# EAGLE schematic reprap (EAGLE 6.3)
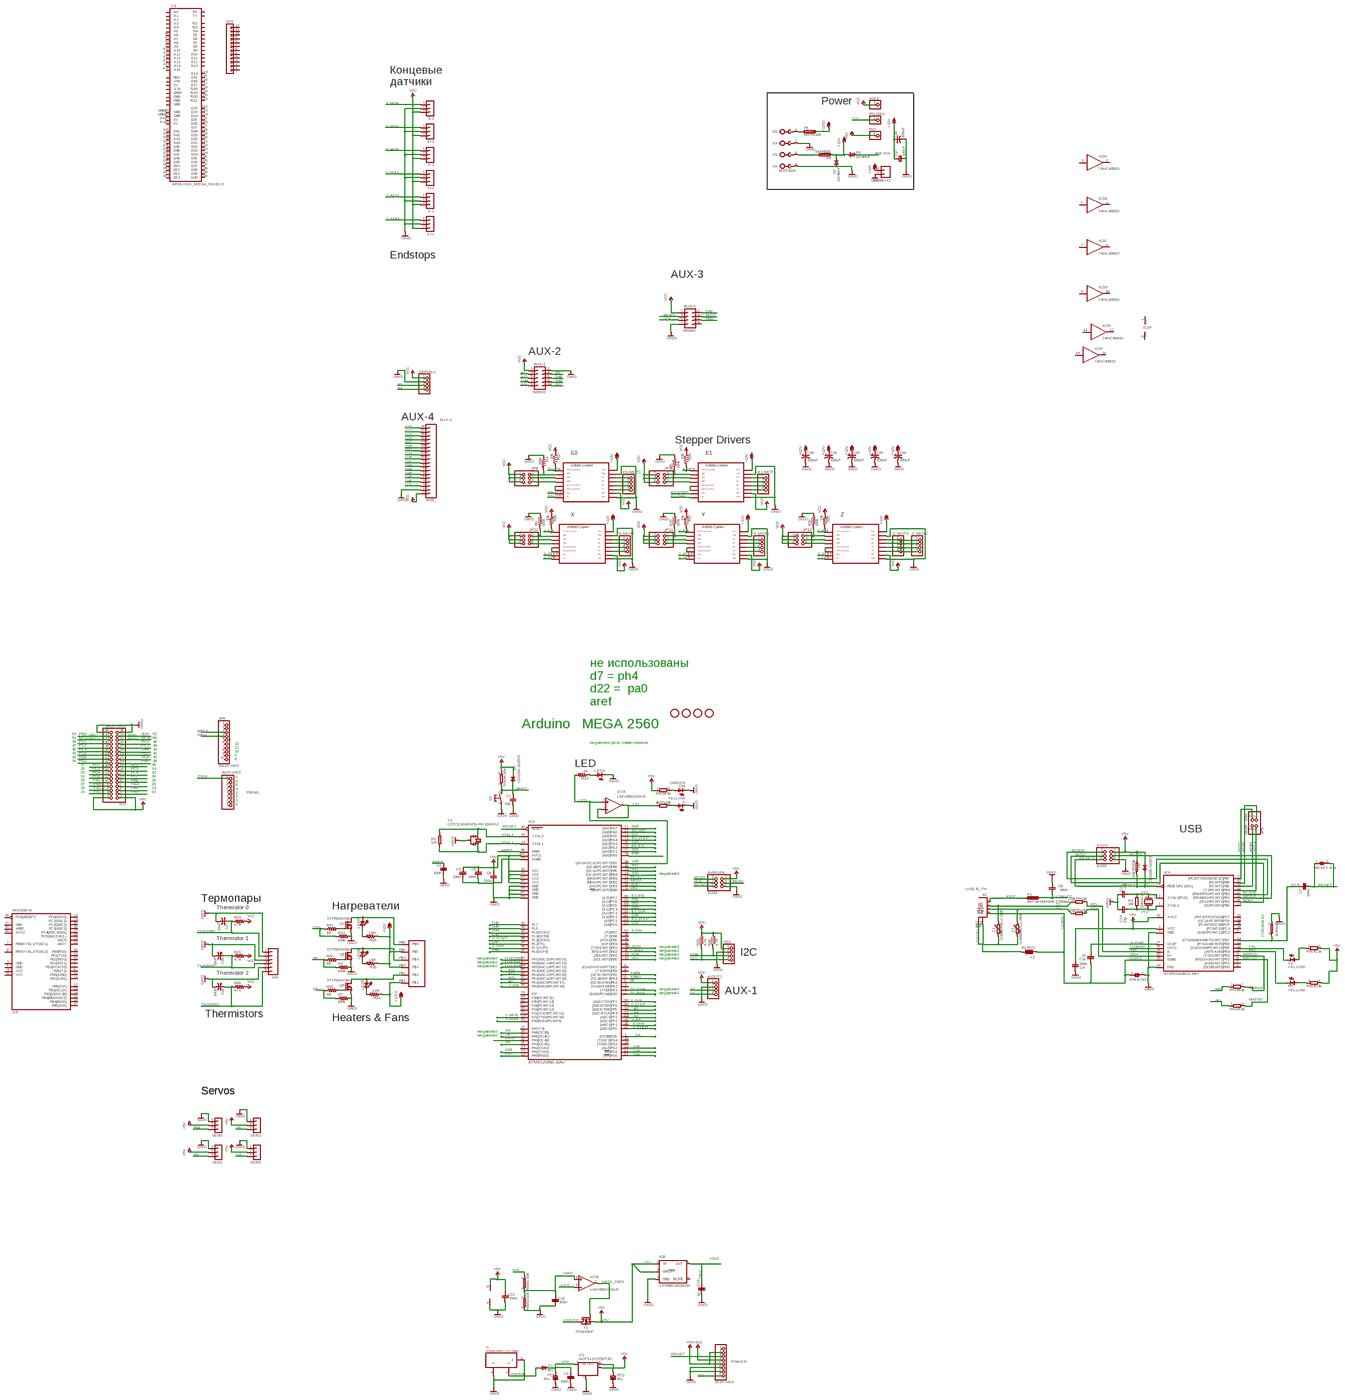
[diagram p0: schematic, sheet 1, overview]
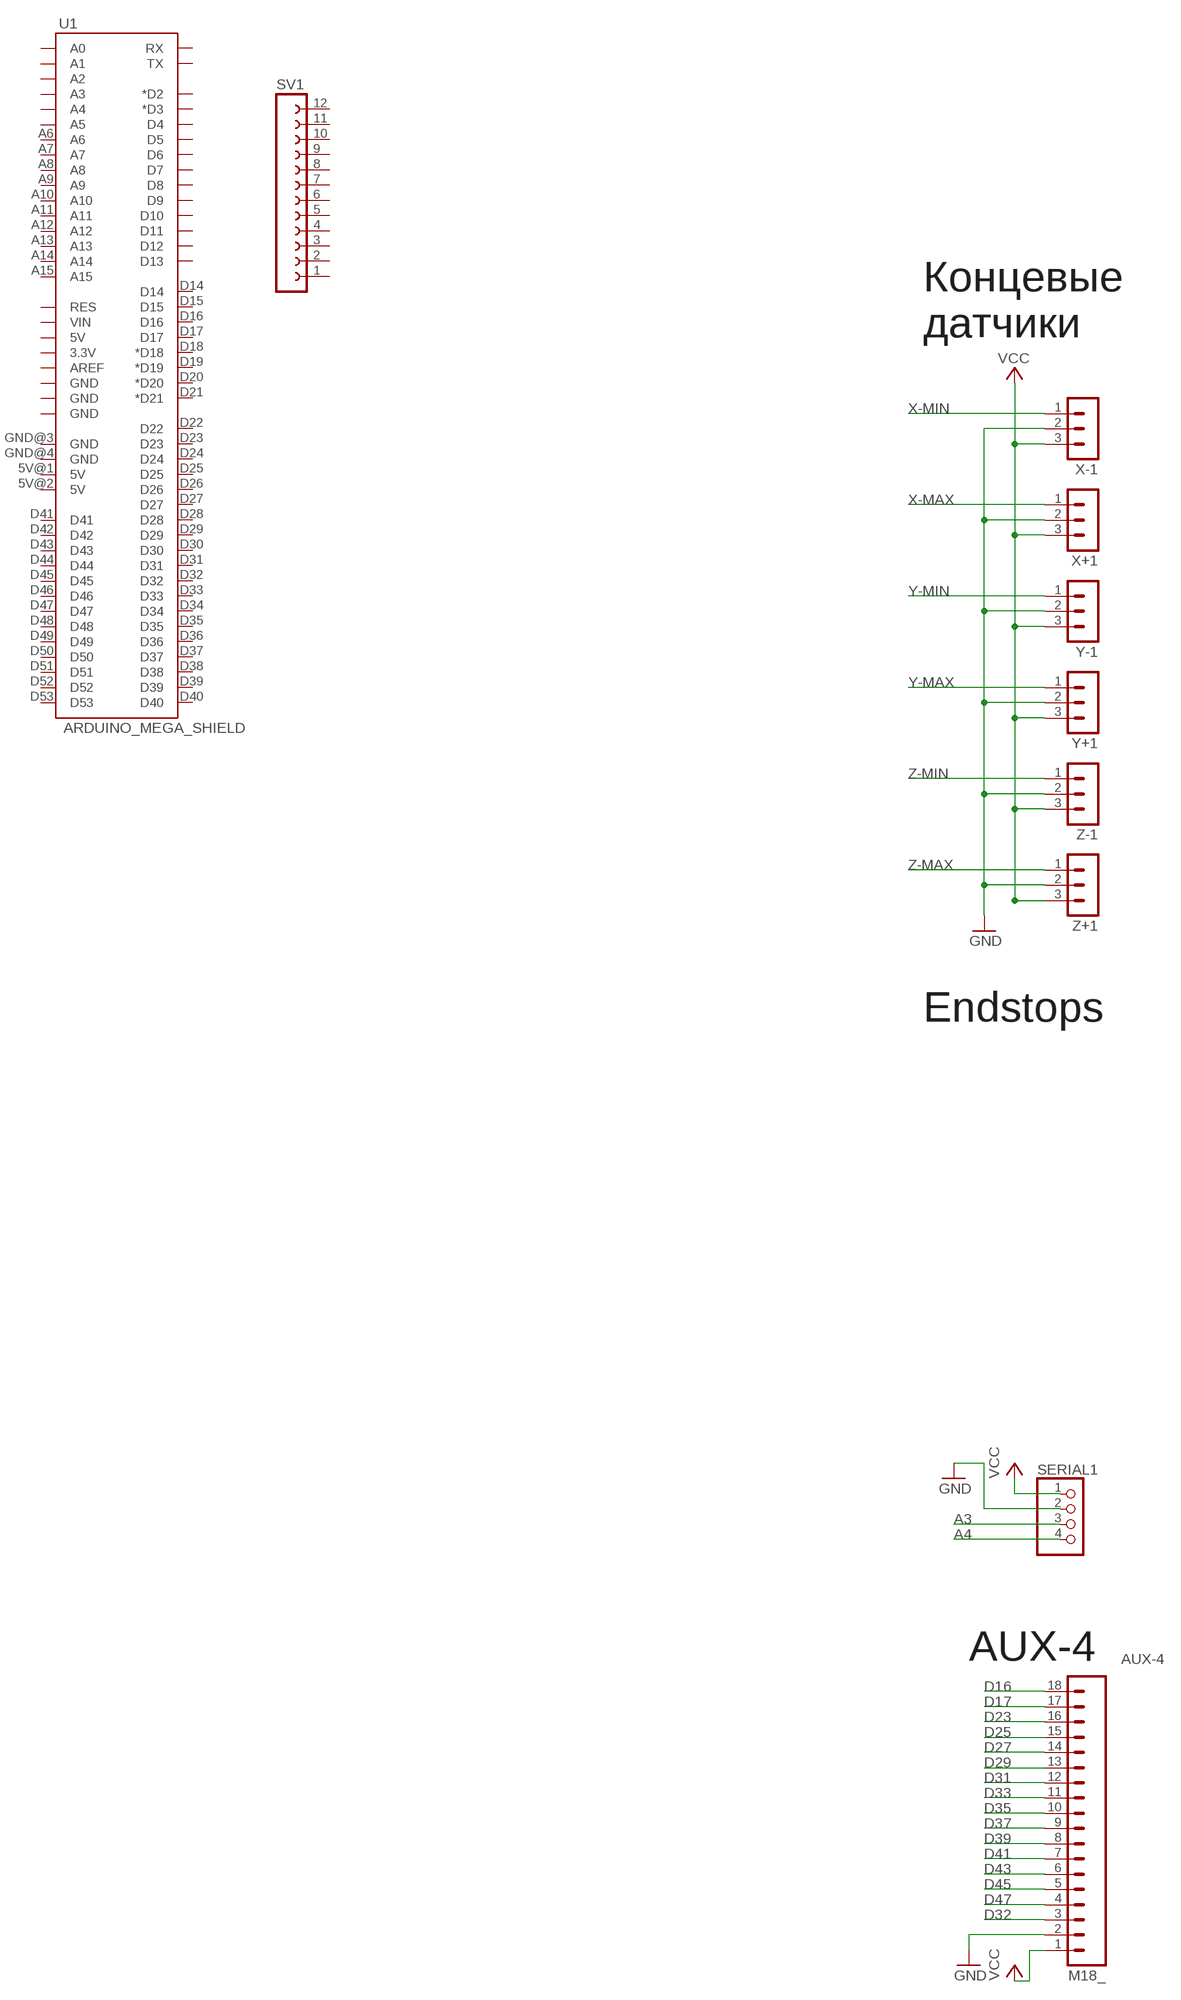
[diagram p1: schematic, sheet 1, part 1 of 4]
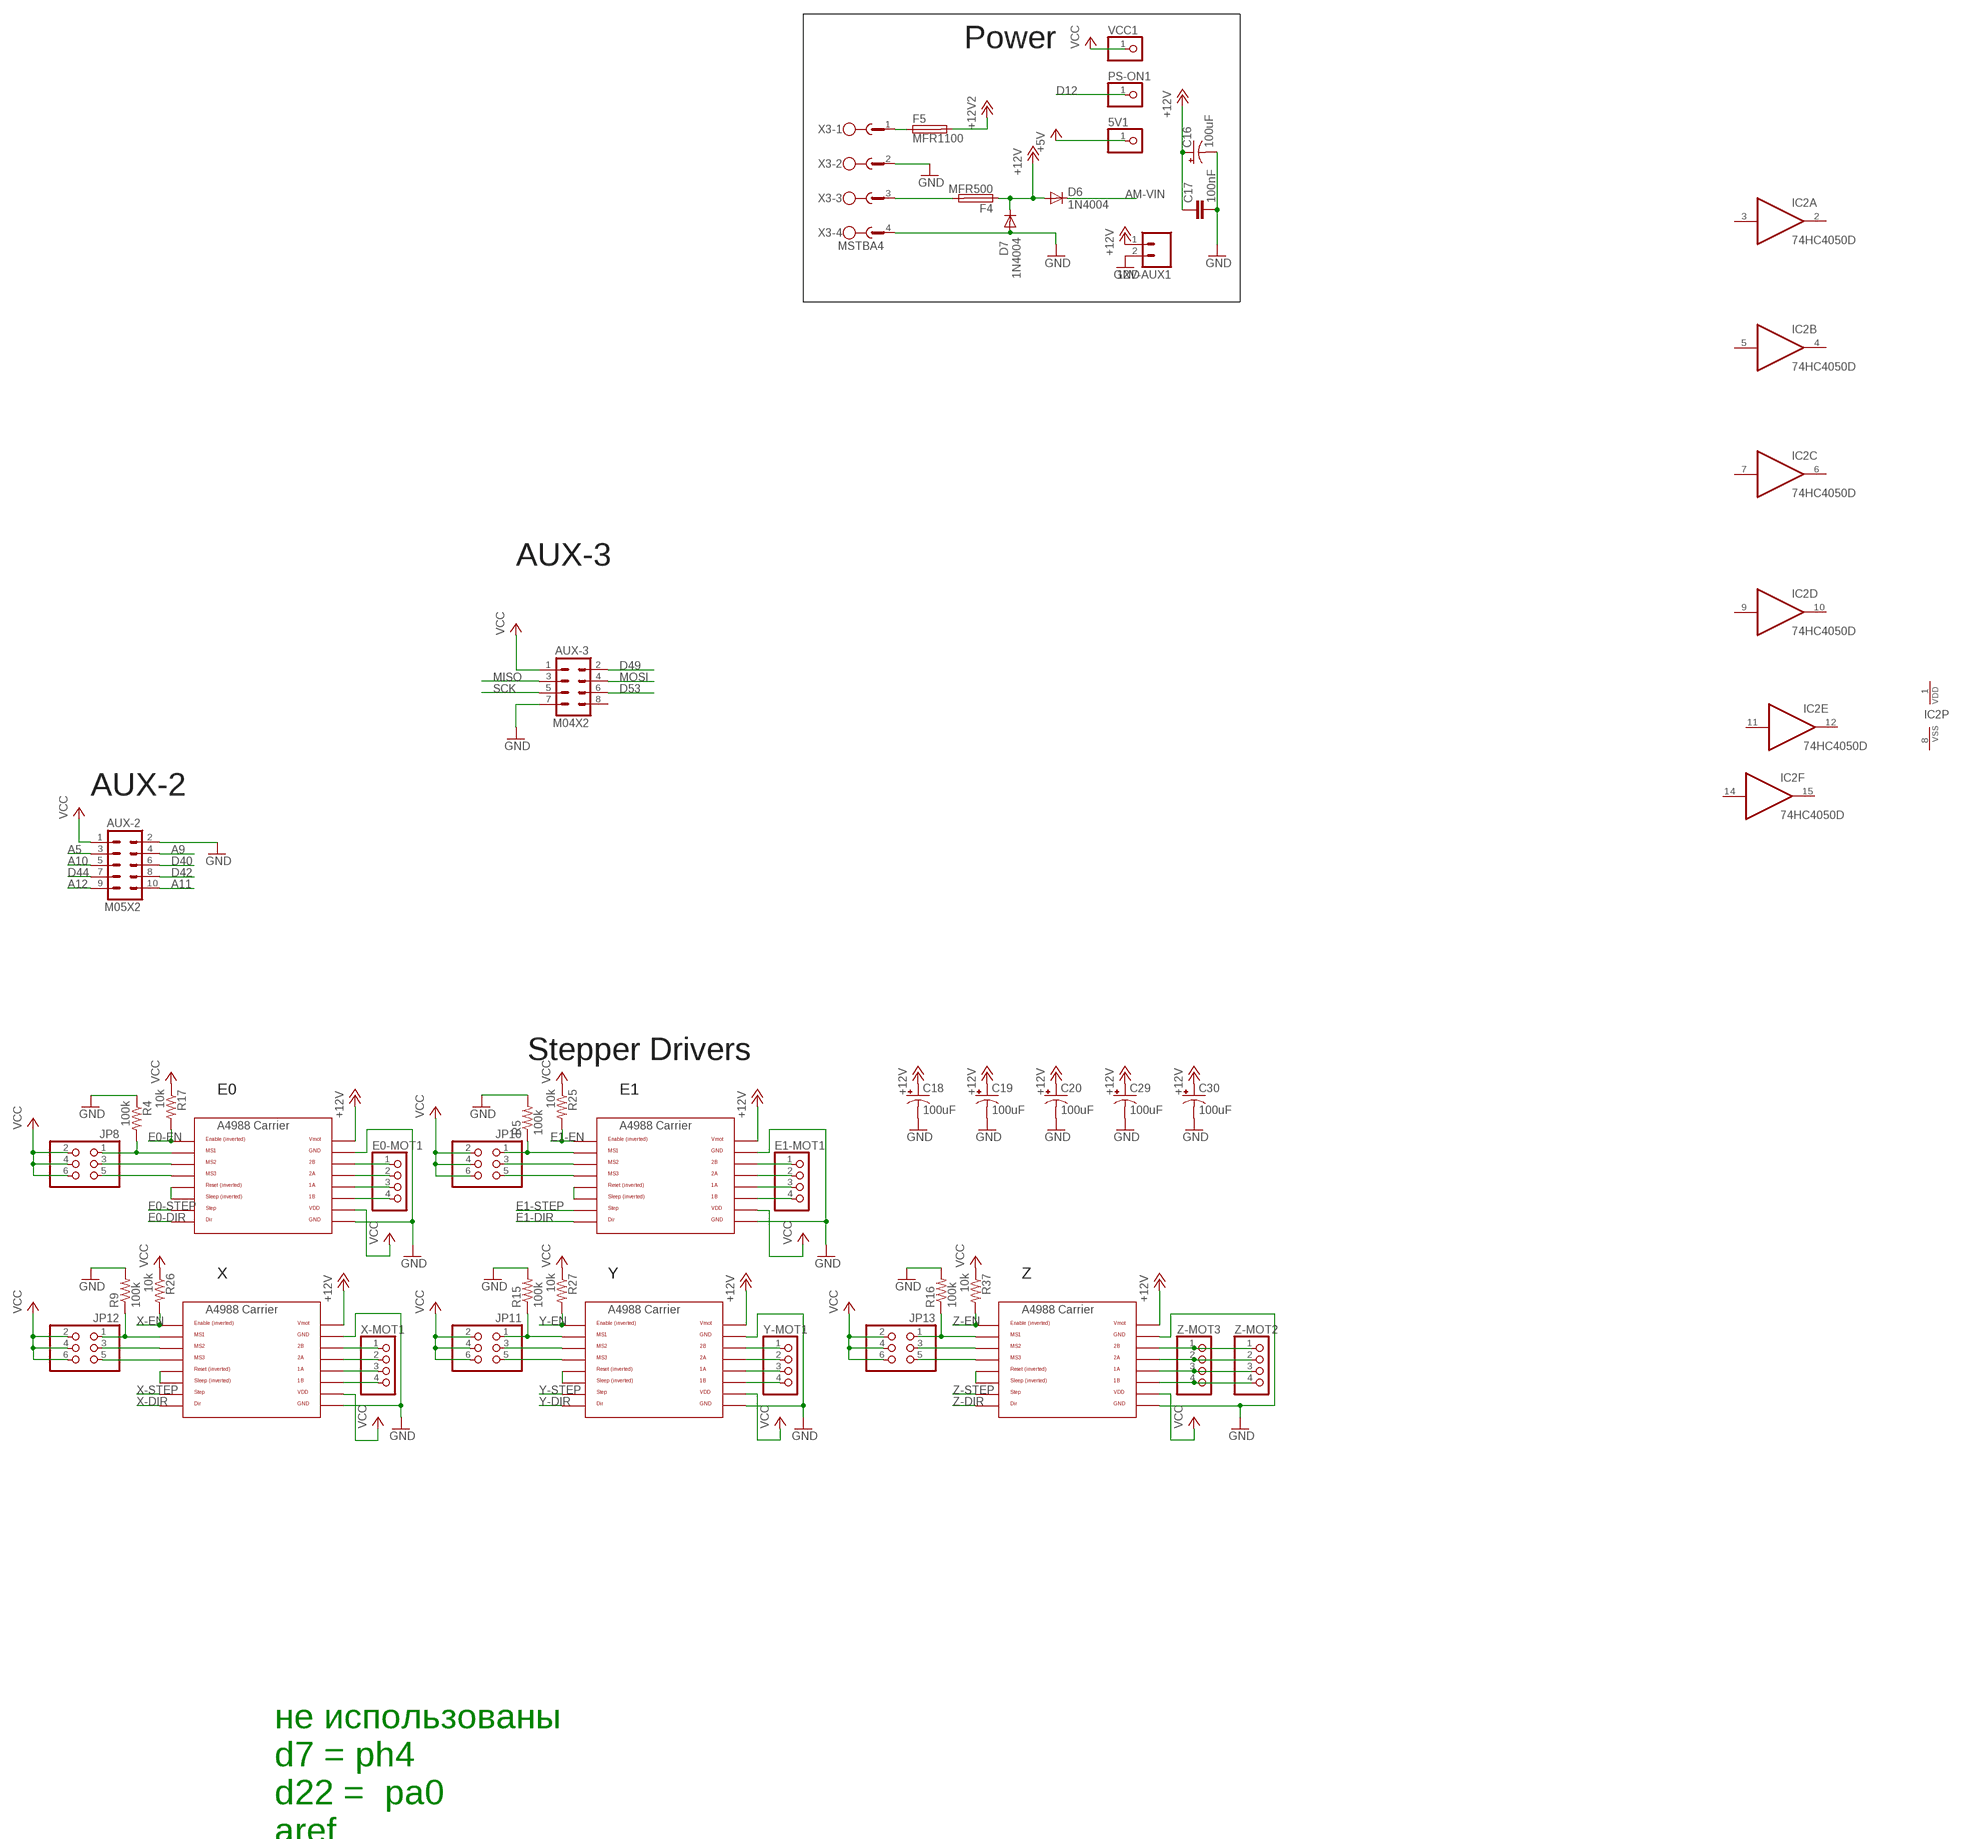
[diagram p2: schematic, sheet 1, part 2 of 4]
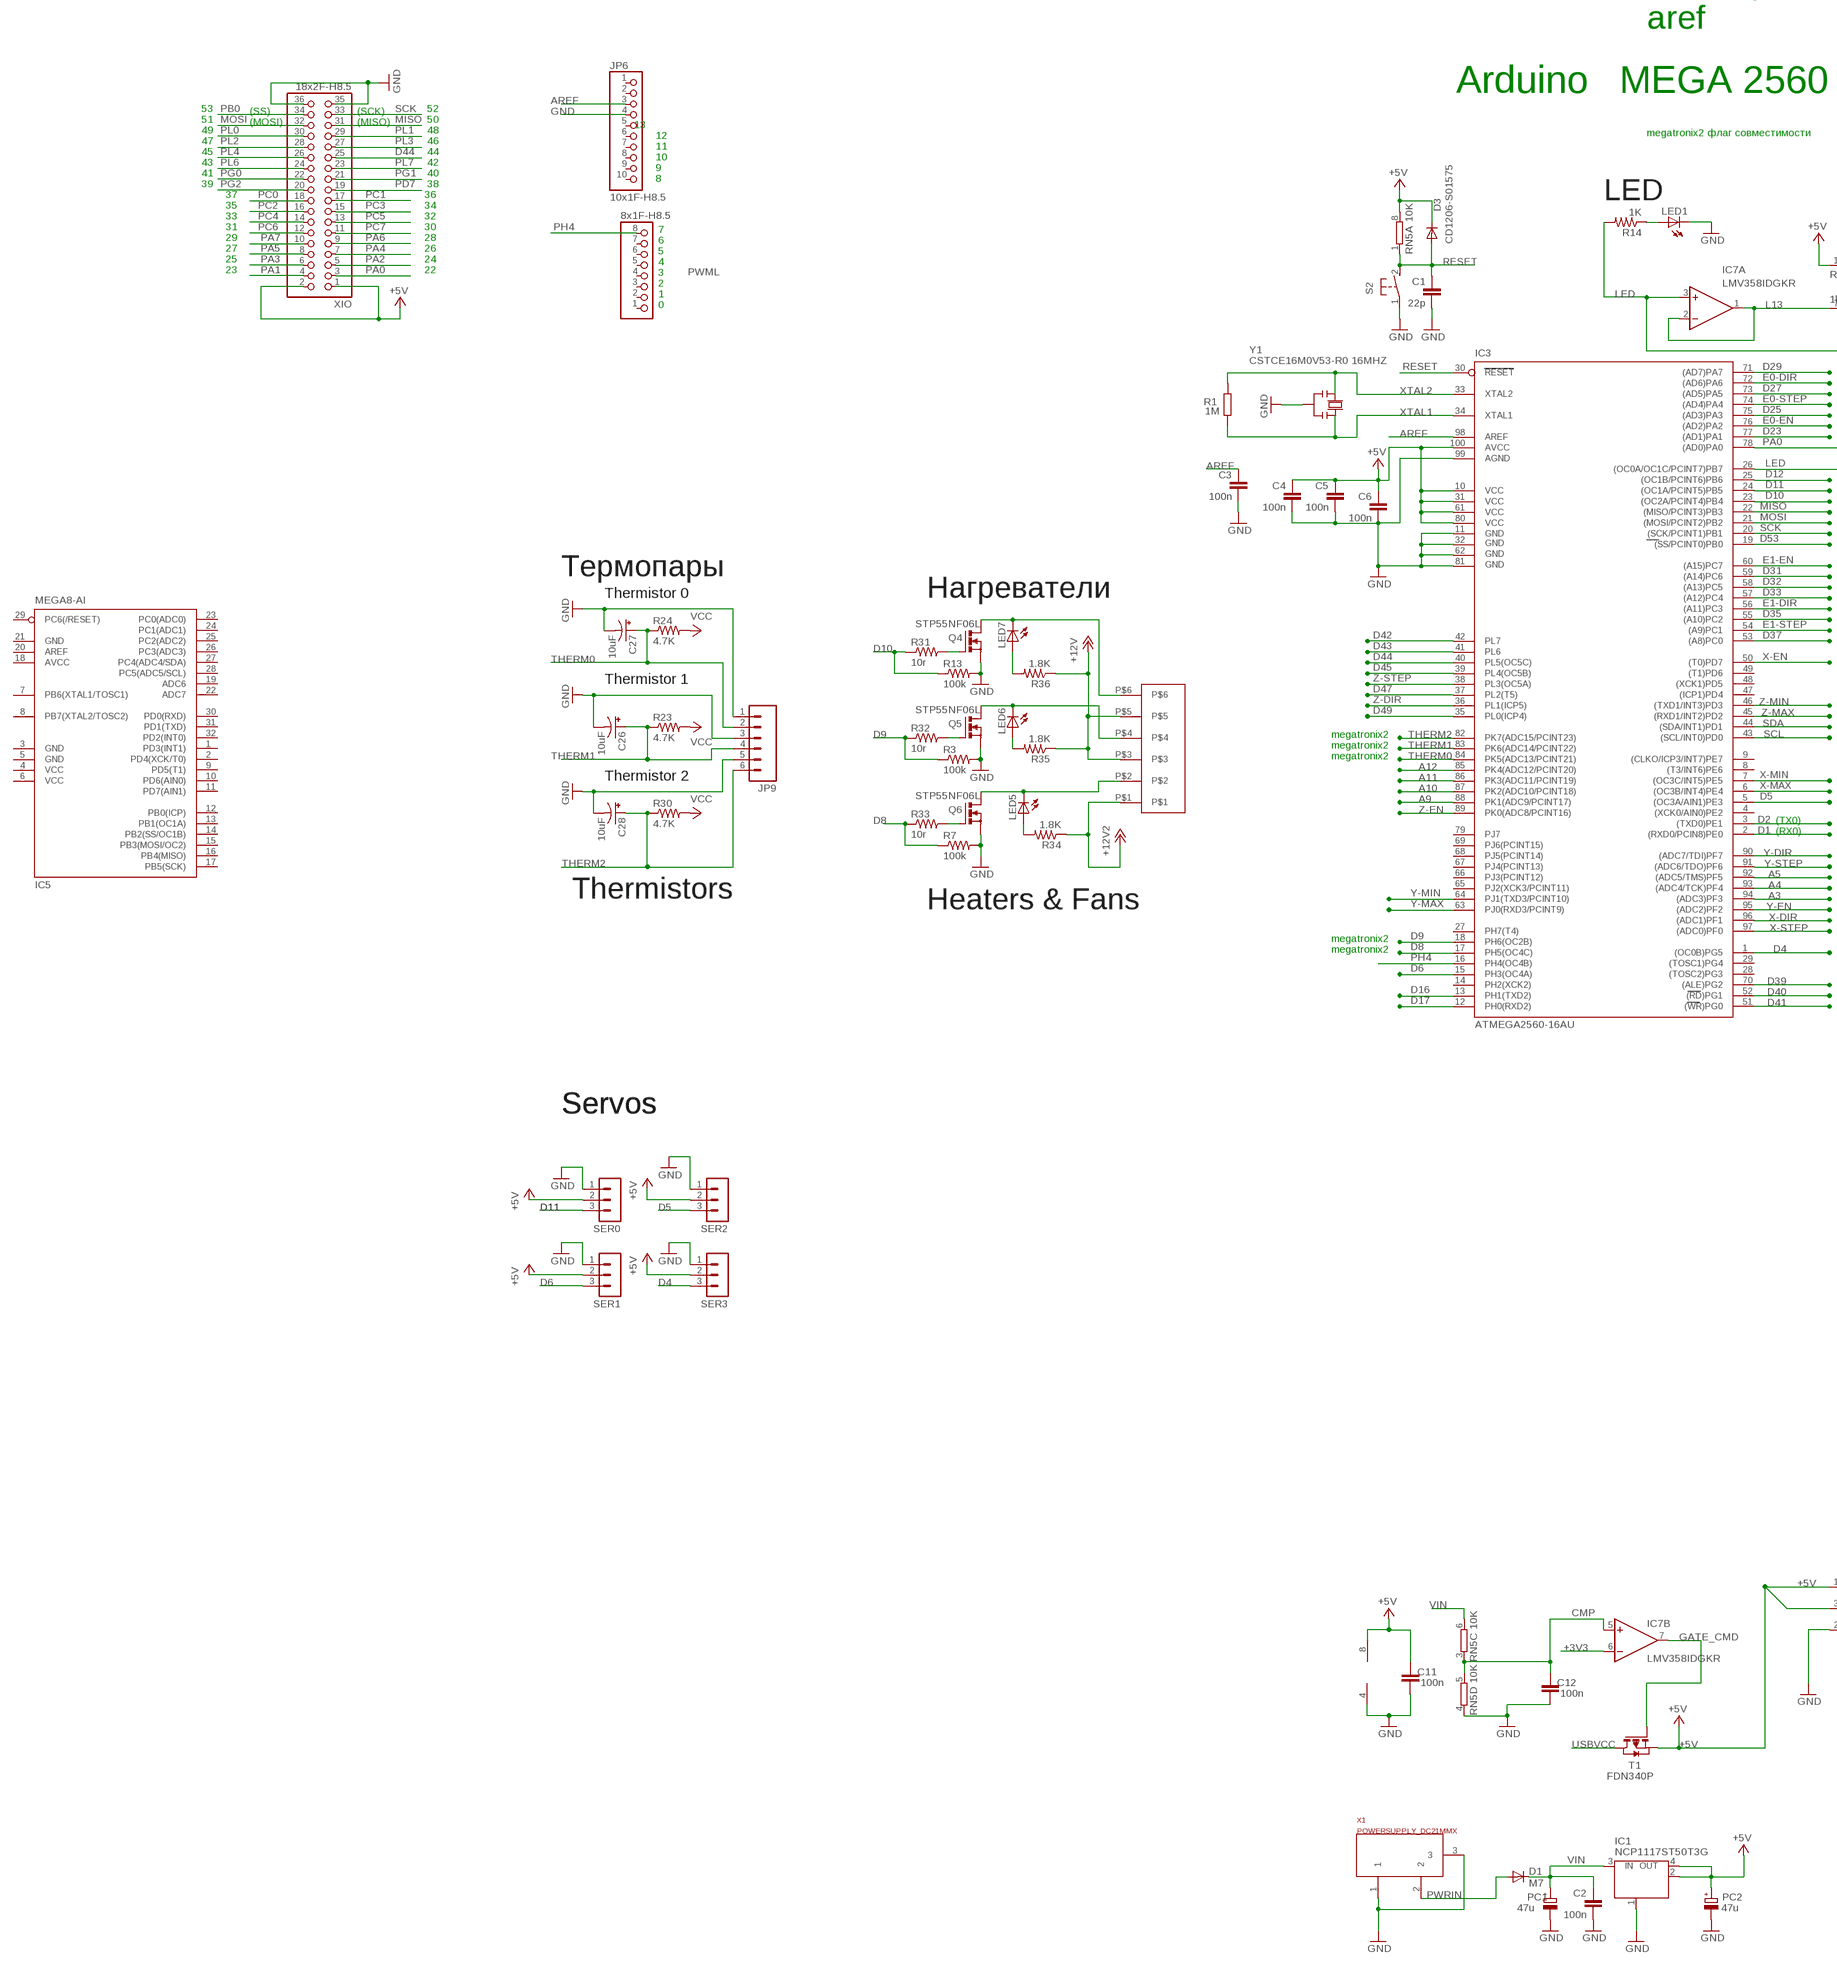
[diagram p3: schematic, sheet 1, part 3 of 4]
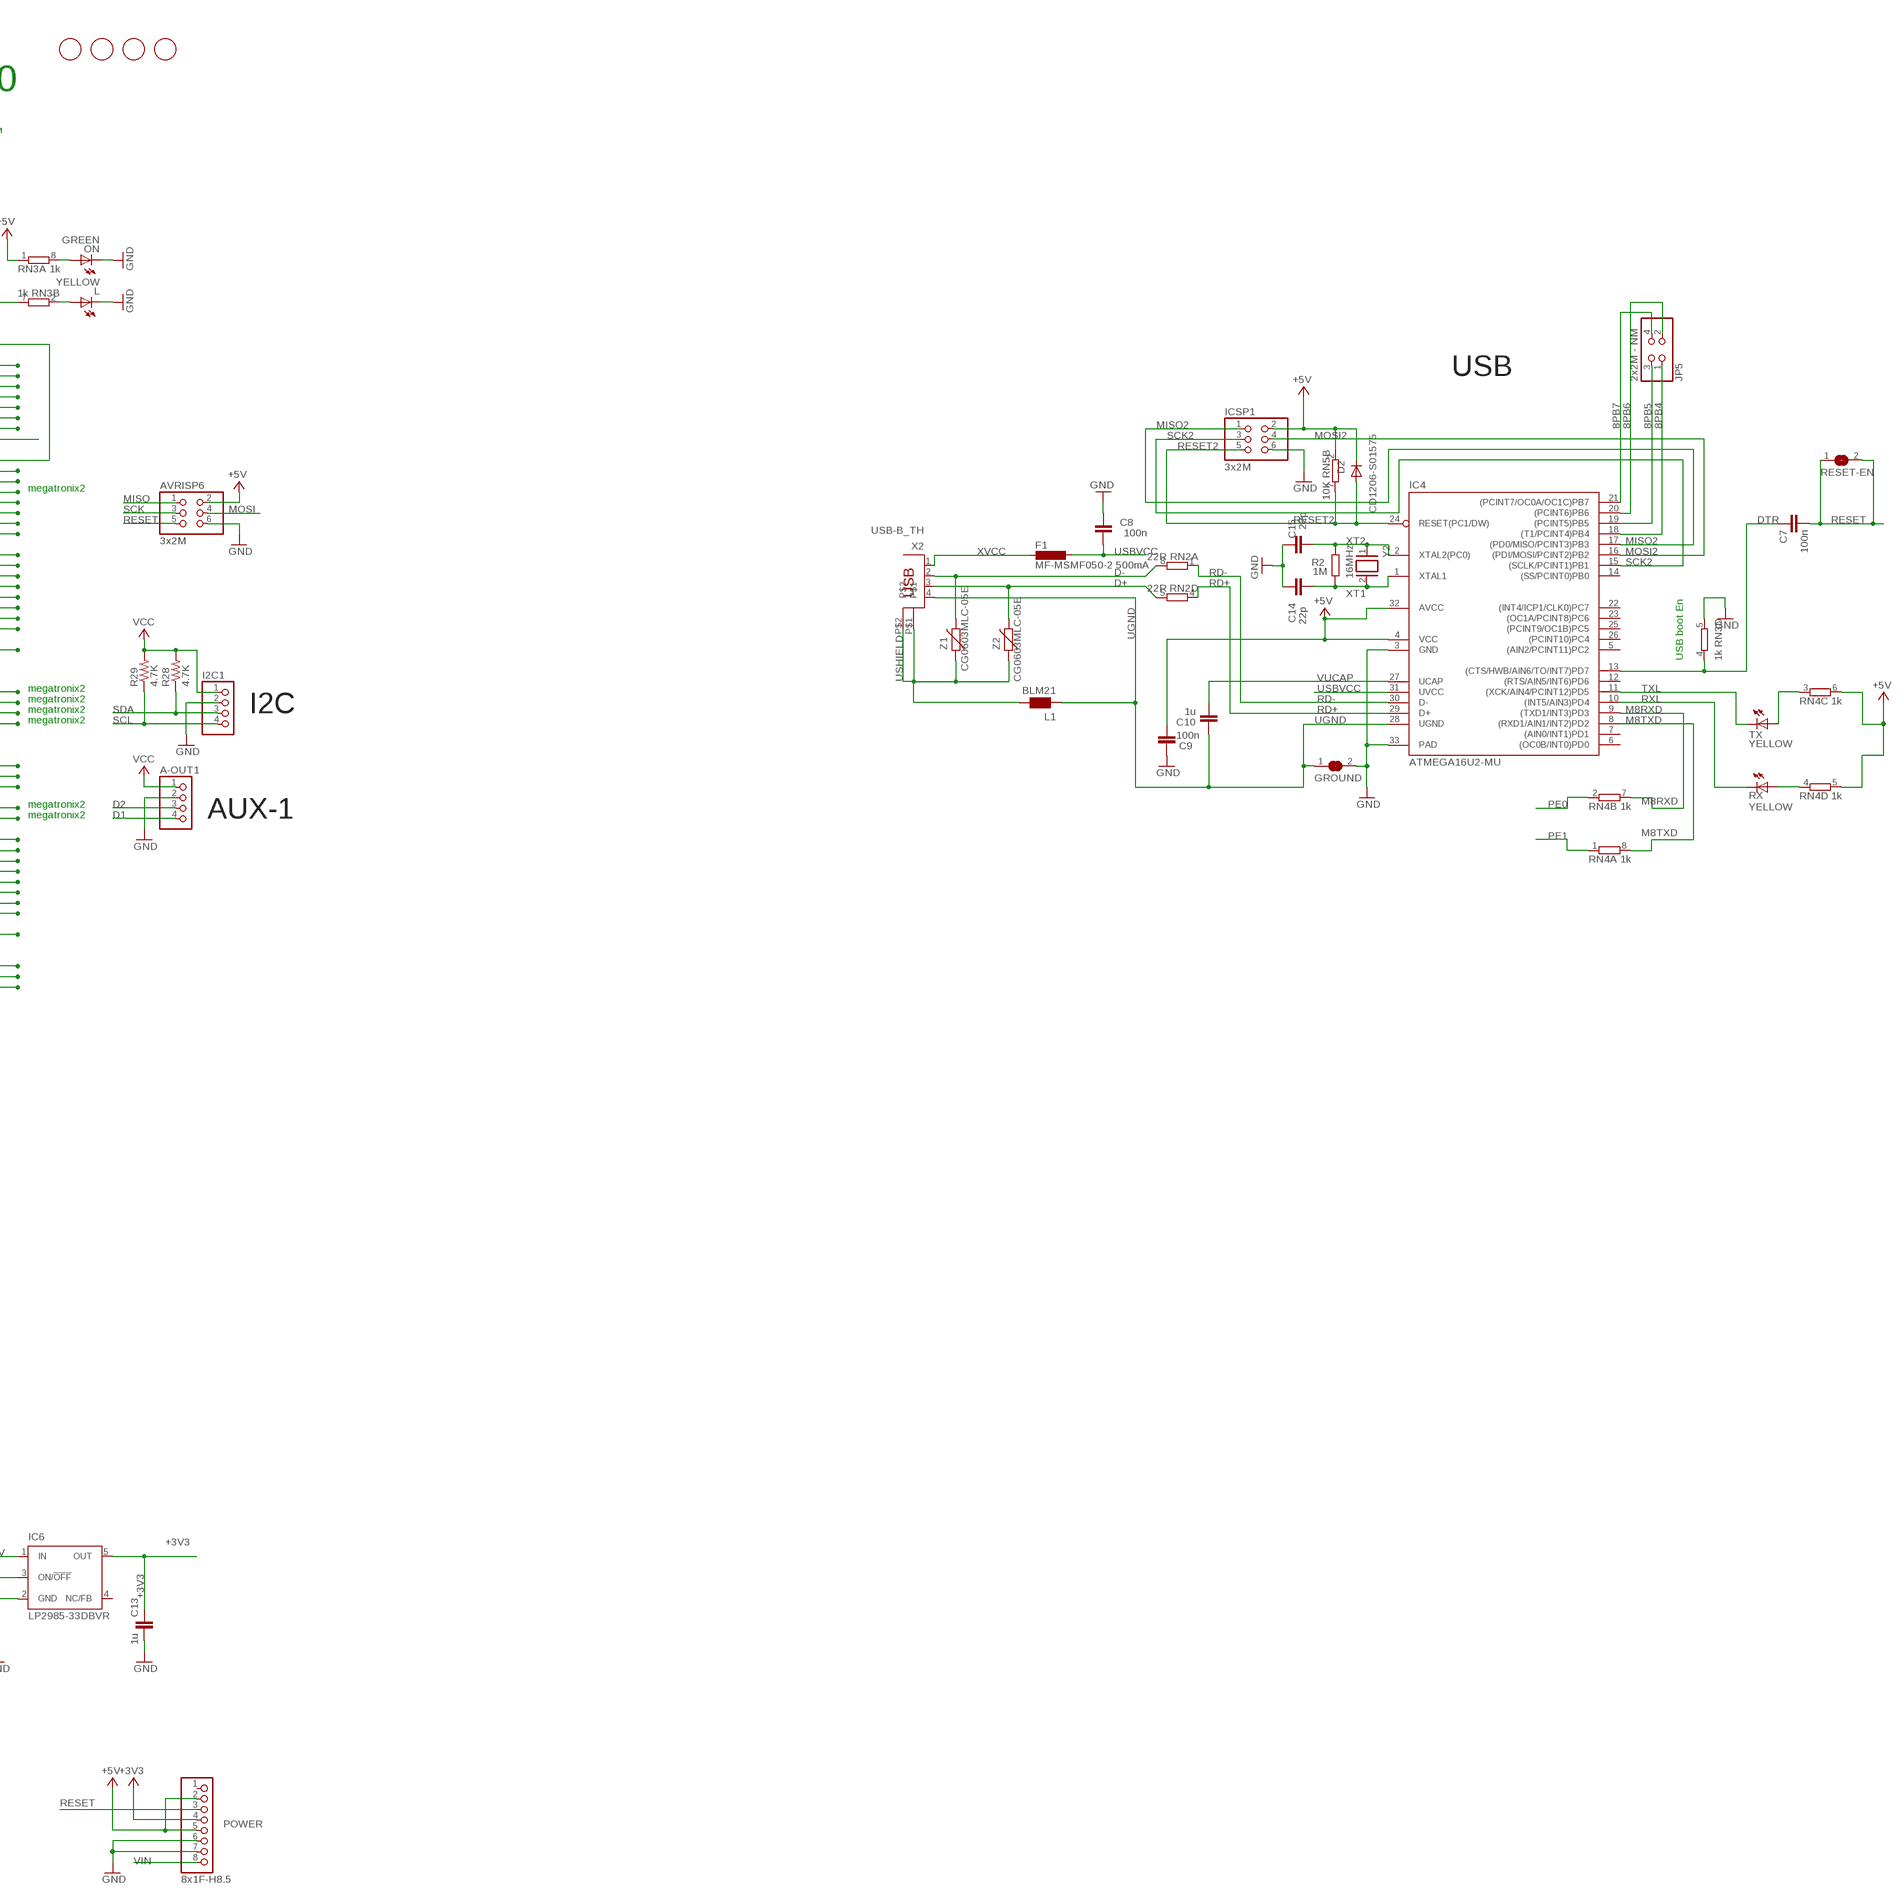
[diagram p4: schematic, sheet 1, part 4 of 4]

## Parts
5V1  PINHD-1X1  [1X01]
12V-AUX1  M02PTH  [1X02]
A-OUT1  PINHD-1X4  [1X04]
AUX-2  M05X2  [2X5]
AUX-3  M04X2  [2X4]
AUX-4  M18_  [1X18]
AVRISP6  3x2M  PINHD-2X3  [2X03]
C1  22p  C-EU0603-RND  [C0603-ROUND]
C2  100n  C-EU0603-RND  [C0603-ROUND]
C3  100n  C-EU0603-RND  [C0603-ROUND]
C4  100n  C-EU0603-RND  [C0603-ROUND]
C5  100n  C-EU0603-RND  [C0603-ROUND]
C6  100n  C-EU0603-RND  [C0603-ROUND]
C7  100n  C-EU0603-RND  [C0603-ROUND]
C8  100n  C-EU0603-RND  [C0603-ROUND]
C9  100n  C-EU0603-RND  [C0603-ROUND]
C10  1u  C-EU0603-RND  [C0603-ROUND]
C11  100n  C-EU0603-RND  [C0603-ROUND]
C12  100n  C-EU0603-RND  [C0603-ROUND]
C13  1u  C-EU0603-RND  [C0603-ROUND]
C14  22p  C-EU0603-RND  [C0603-ROUND]
C15  22p  C-EU0603-RND  [C0603-ROUND]
C16  100uF  CPOL-US153CLV-0605  [153CLV-0605]
C17  100nF  C-EUC0805  [C0805]
C18  100uF  CPOL-US153CLV-0605  [153CLV-0605]
C19  100uF  CPOL-US153CLV-0605  [153CLV-0605]
C20  100uF  CPOL-US153CLV-0605  [153CLV-0605]
C26  10uF  CPOL-US153CLV-0405  [153CLV-0405]
C27  10uF  CPOL-US153CLV-0405  [153CLV-0405]
C28  10uF  CPOL-US153CLV-0405  [153CLV-0405]
C29  100uF  CPOL-US153CLV-0605  [153CLV-0605]
C30  100uF  CPOL-US153CLV-0605  [153CLV-0605]
D1  M7  DIODE-SMB  [SMB]
D2  CD1206-S01575  DIODE-MINIMELF  [MINIMELF]
D3  CD1206-S01575  DIODE-MINIMELF  [MINIMELF]
D6  1N4004  [DO41-10]
D7  1N4004  [DO41-10]
E0-MOT1  PINHD-1X4  [1X04]
E1-MOT1  PINHD-1X4  [1X04]
F1  MF-MSMF050-2 500mA  L-EUL1812  [L1812]
F4  MFR500  PTCFUSE  [MFR500]
F5  MFR1100  PTCFUSEMFR1100  [MFR1100]
FD1  FIDUCIALMOUNT  [FIDUCIA-MOUNT]
FD2  FIDUCIALMOUNT  [FIDUCIA-MOUNT]
FD3  FIDUCIALMOUNT  [FIDUCIA-MOUNT]
FD4  FIDUCIALMOUNT  [FIDUCIA-MOUNT]
GROUND  SJ  [SJ]
I2C1  PINHD-1X4  [1X04]
IC1  NCP1117ST50T3G  MC33269ST-3.3T3  [SOT223]
IC2  74HC4050D  4050D  [SO16]
IC3  ATMEGA2560-16AU  ATMEGA25602560-16AU  [TQFP100]
IC4  ATMEGA16U2-MU  [MLF32]
IC5  MEGA8-AI  [TQFP32-08]
IC6  LP2985-33DBVR  LP2985-XXDBVR33  [SOT23-DBV]
IC7  LMV358IDGKR  LMV358MMX  [MSOP08]
ICSP1  3x2M  PINHD-2X3  [2X03]
JP5  2x2M - NM  PINHD-2X2  [2X02]
JP6  10x1F-H8.5  PINHD-1X10_ARD  [1X10]
JP8  PINHD-2X3  [2X03]
JP9  M06SIP  [1X06]
JP10  PINHD-2X3  [2X03]
JP11  PINHD-2X3  [2X03]
JP12  PINHD-2X3  [2X03]
JP13  PINHD-2X3  [2X03]
L  YELLOW  LEDCHIP-LED0805  [CHIP-LED0805]
L1  BLM21  WE-CBF_0805  [0805]
LED1  LEDCHIP-LED0805  [CHIP-LED0805]
LED5  LEDCHIP-LED0805  [CHIP-LED0805]
LED6  LEDCHIP-LED0805  [CHIP-LED0805]
LED7  LEDCHIP-LED0805  [CHIP-LED0805]
ON  GREEN  LEDCHIP-LED0805  [CHIP-LED0805]
PC1  47u  CPOL-EUD  [PANASONIC_D]
PC2  47u  CPOL-EUD  [PANASONIC_D]
POWER  8x1F-H8.5  PINHD-1X8  [1X08]
PS-ON1  PINHD-1X1  [1X01]
PWML  8x1F-H8.5  PINHD-1X8  [1X08]
Q4  STP55NF06L  IRF512  [TO220BV]
Q5  STP55NF06L  IRF512  [TO220BV]
Q6  STP55NF06L  IRF512  [TO220BV]
R1  1M  R-EU_R0603  [R0603-ROUND]
R2  1M  R-EU_R0603  [R0603-ROUND]
R3  100k  R-US_R0805  [R0805]
R4  100k  R-US_R0805  [R0805]
R5  100k  R-US_R0805  [R0805]
R7  100k  R-US_R0805  [R0805]
R9  100k  R-US_R0805  [R0805]
R13  100k  R-US_R0805  [R0805]
R14  1K  R-US_R0805  [R0805]
R15  100k  R-US_R0805  [R0805]
R16  100k  R-US_R0805  [R0805]
R17  10k  R-US_R0805  [R0805]
R23  4.7K  R-US_R0805  [R0805]
R24  4.7K  R-US_R0805  [R0805]
R25  10k  R-US_R0805  [R0805]
R26  10k  R-US_R0805  [R0805]
R27  10k  R-US_R0805  [R0805]
R28  4.7K  R-US_R0805  [R0805]
R29  4.7K  R-US_R0805  [R0805]
R30  4.7K  R-US_R0805  [R0805]
R31  10r  R-US_R0805  [R0805]
R32  10r  R-US_M0805  [M0805]
R33  10r  R-US_R0805  [R0805]
R34  1.8K  R-US_R0805  [R0805]
R35  1.8K  R-US_R0805  [R0805]
R36  1.8K  R-US_R0805  [R0805]
R37  10k  R-US_R0805  [R0805]
RESET-EN  SJ  [SJ]
RN2  22R  4R-NCAY16  [CAY16]
RN3  1k  4R-NCAY16  [CAY16]
RN4  1k  4R-NCAY16  [CAY16]
RN5  10K  4R-NCAT16  [CAT16]
RX  YELLOW  LEDCHIP-LED0805  [CHIP-LED0805]
S2  31-XX  [B3F-31XX]
SER0  3PIN-HEADER  [3PIN-HEADER]
SER1  3PIN-HEADER  [3PIN-HEADER]
SER2  3PIN-HEADER  [3PIN-HEADER]
SER3  3PIN-HEADER  [3PIN-HEADER]
SERIAL1  PINHD-1X4  [1X04]
SV1  FE12-1  [FE12]
T1  FDN340P  PMOSSOT23  [SOT-23]
TX  YELLOW  LEDCHIP-LED0805  [CHIP-LED0805]
U1  ARDUINO_MEGA_SHIELD  [ARDUINO_MEGA_SHIELD]
U$1  282837-6  [282837-6]
U$2  A4988BREAKOUT  [A4988BREAKOUT]
U$3  A4988BREAKOUT  [A4988BREAKOUT]
U$9  A4988BREAKOUT  [A4988BREAKOUT]
U$10  A4988BREAKOUT  [A4988BREAKOUT]
U$11  A4988BREAKOUT  [A4988BREAKOUT]
VCC1  PINHD-1X1  [1X01]
X1  POWERSUPPLY_DC21MMX  [POWERSUPPLY_DC-21MM]
X2  USB-B_TH  PN61729  [PN61729]
X3  MSTBA4  [MSTBA4]
X+1  3PIN-HEADER  [3PIN-HEADER]
X-1  3PIN-HEADER  [3PIN-HEADER]
X-MOT1  PINHD-1X4  [1X04]
XIO  18x2F-H8.5  PINHD-2X18  [2X18]
Y1  CSTCE16M0V53-R0 16MHZ  RESONATORMU  [RESONATOR]
Y2  16MHz  XTAL/S  [QS]
Y+1  3PIN-HEADER  [3PIN-HEADER]
Y-1  3PIN-HEADER  [3PIN-HEADER]
Y-MOT1  PINHD-1X4  [1X04]
Z1  CG0603MLC-05E  VARISTORCN0603  [CT/CN0603]
Z2  CG0603MLC-05E  VARISTORCN0603  [CT/CN0603]
Z+1  3PIN-HEADER  [3PIN-HEADER]
Z-1  3PIN-HEADER  [3PIN-HEADER]
Z-MOT2  PINHD-1X4  [1X04]
Z-MOT3  PINHD-1X4  [1X04]

## Nets
8PB4: IC4.18((T1/PCINT4)PB4) JP5.1
8PB5: IC4.19((PCINT5)PB5) JP5.3
8PB6: IC4.20((PCINT6)PB6) JP5.2
8PB7: IC4.21((PCINT7/OC0A/OC1C)PB7) JP5.4
+3V3 [power]: C13.2 IC6.5(OUT) IC7.6(B:-IN) POWER.4
+5V [power usb]: 5V1.1 AVRISP6.2 C4.1 C5.1 C6.1 C9.1 C11.2 D2.C D3.C IC1.2(OUT) IC1.4(OUT) IC3.10(VCC) IC3.31(VCC1) IC3.61(VCC2) IC3.80(VCC3) IC3.100(AVCC) IC4.4(VCC) IC4.32(AVCC) IC6.1(IN) IC6.3(ON/!OFF) IC7.8(P:V+) ICSP1.2 PC2.+ POWER.2 POWER.5 RN3.1 RN4.5 RN4.6 RN5.2 RN5.8 SER0.2 SER1.2 SER2.2 SER3.2 T1.2(S) XIO.1 XIO.2
+12V: 12V-AUX1.1 C16.+ C17.1 C18.+ C19.+ C20.+ C29.+ C30.+ D6.A D7.C F4.1 R35.1 R36.1 U$1.P$3 U$1.P$5 U$2.VMOT U$3.VMOT U$9.VMOT U$10.VMOT U$11.VMOT
+12V2: F5.2 R34.1 U$1.P$1
A3: IC3.94((ADC3)PF3) SERIAL1.3
A4: IC3.93((ADC4/TCK)PF4) SERIAL1.4
A5: AUX-2.3 IC3.92((ADC5/TMS)PF5)
A9: AUX-2.4 IC3.88(PK1(ADC9/PCINT17))
A10: AUX-2.5 IC3.87(PK2(ADC10/PCINT18))
A11: AUX-2.10 IC3.86(PK3(ADC11/PCINT19))
A12: AUX-2.9 IC3.85(PK4(ADC12/PCINT20))
AM-VIN: D6.C
AREF: C3.1 IC3.98(AREF) JP6.3
CMP: C12.2 IC7.5(B:+IN) RN5.3 RN5.5
D1: A-OUT1.4 IC3.2((RXD0/PCIN8)PE0)
D2: A-OUT1.3 IC3.3((TXD0)PE1)
D4: IC3.1((OC0B)PG5) SER3.3
D5: IC3.5((OC3A/AIN1)PE3) SER2.3
D6: IC3.15(PH3(OC4A)) SER1.3
D8: IC3.17(PH5(OC4C)) R7.1 R33.1
D9: IC3.18(PH6(OC2B)) R3.1 R32.1
D10: IC3.23((OC2A/PCINT4)PB4) R13.1 R31.1
D11: IC3.24((OC1A/PCINT5)PB5) SER0.3
D12: IC3.25((OC1B/PCINT6)PB6) PS-ON1.1
D16: AUX-4.18 IC3.13(PH1(TXD2))
D17: AUX-4.17 IC3.12(PH0(RXD2))
D23: AUX-4.16 IC3.77((AD1)PA1)
D25: AUX-4.15 IC3.75((AD3)PA3)
D27: AUX-4.14 IC3.73((AD5)PA5)
D29: AUX-4.13 IC3.71((AD7)PA7)
D31: AUX-4.12 IC3.59((A14)PC6)
D32: AUX-4.3 IC3.58((A13)PC5)
D33: AUX-4.11 IC3.57((A12)PC4)
D35: AUX-4.10 IC3.55((A10)PC2)
D37: AUX-4.9 IC3.53((A8)PC0)
D39: AUX-4.8 IC3.70((ALE)PG2)
D40: AUX-2.6 IC3.52((RD)PG1)
D41: AUX-4.7 IC3.51((WR)PG0)
D42: AUX-2.8 IC3.42(PL7)
D43: AUX-4.6 IC3.41(PL6)
D44: AUX-2.7 IC3.40(PL5(OC5C)) XIO.25
D45: AUX-4.5 IC3.39(PL4(OC5B))
D47: AUX-4.4 IC3.37(PL2(T5))
D49: AUX-3.2 IC3.35(PL0(ICP4))
D53: AUX-3.6 IC3.19((SS/PCINT0)PB0)
D+: RN2.5 X2.3 Z2.2
D-: RN2.8 X2.2 Z1.2
DTR: C7.1 IC4.13((CTS/HWB/AIN6/TO/INT7)PD7) RN3.4
E0-DIR: IC3.72((AD6)PA6) U$2.DIR
E0-EN: IC3.76((AD2)PA2) R17.2 U$2.EN
E0-STEP: IC3.74((AD4)PA4) U$2.STEP
E1-DIR: IC3.56((A11)PC3) U$3.DIR
E1-EN: IC3.60((A15)PC7) R25.2 U$3.EN
E1-STEP: IC3.54((A9)PC1) U$3.STEP
GATE_CMD: IC7.7(B:OUT) T1.3(G)
GND [gnd]: 12V-AUX1.2 A-OUT1.2 AUX-2.2 AUX-3.7 AUX-4.2 AVRISP6.6 C1.2 C2.2 C3.2 C4.2 C5.2 C6.2 C8.2 C9.2 C11.1 C12.1 C13.1 C14.2 C15.2 C16.- C17.2 C18.- C19.- C20.- C26.- C27.- C28.- C29.- C30.- D7.A GROUND.2 I2C1.2 IC1.1(GND/ADJ) IC3.11(GND) IC3.32(GND1) IC3.62(GND2) IC3.81(GND3) IC3.99(AGND) IC4.3(GND) IC4.33(PAD) IC6.2(GND) IC7.4(P:V-) ICSP1.6 JP6.4 JP9.1 JP9.3 JP9.5 L.C LED1.C ON.C PC1.- PC2.- POWER.6 POWER.7 Q4.S Q5.S Q6.S R3.2 R4.1 R5.2 R7.2 R9.2 R13.2 R15.2 R16.2 RN3.5 RN5.4 S2.1(P) SER0.1 SER1.1 SER2.1 SER3.1 SERIAL1.2 U$2.GND U$2.GND@0(GND) U$3.GND U$3.GND@0(GND) U$9.GND U$9.GND@0(GND) U$10.GND U$10.GND@0(GND) U$11.GND U$11.GND@0(GND) X1.1 X1.3 X3.2 X3.4 X+1.2 X-1.2 XIO.35 XIO.36 Y1.2 Y+1.2 Y-1.2 Z+1.2 Z-1.2
L13: IC7.1(A:OUT) IC7.2(A:-IN) RN3.7
LED: IC3.26((OC0A/OC1C/PCINT7)PB7) IC7.3(A:+IN) R14.2
M8RXD: IC4.9((TXD1/INT3)PD3) RN4.7
M8TXD: IC4.8((RXD1/AIN1/INT2)PD2) RN4.8
MISO: AUX-3.3 AVRISP6.1 IC3.22((MISO/PCINT3)PB3) XIO.31
MISO2: IC4.17((PD0/MISO/PCINT3)PB3) ICSP1.1
MOSI: AUX-3.4 AVRISP6.4 IC3.21((MOSI/PCINT2)PB2) XIO.32
MOSI2: IC4.16((PDI/MOSI/PCINT2)PB2) ICSP1.4
N$1: F5.1 X3.1
N$2: L.A RN3.2
N$3: ON.A RN3.8
N$7: F4.2 X3.3
N$46: LED6.C Q5.D U$1.P$4
N$47: JP8.5 U$2.MS3
N$48: U$2.RST U$2.SLP(SLEEP)
N$49: JP12.5 U$9.MS3
N$50: U$9.RST U$9.SLP(SLEEP)
N$52: JP11.3 U$10.MS2
N$54: RN4.4 RX.A
N$55: RN4.3 TX.A
N$56: U$10.RST U$10.SLP(SLEEP)
N$58: LED1.A R14.1
N$59: LED5.C Q6.D U$1.P$2
N$60: LED7.C Q4.D U$1.P$6
N$61: Q5.G R32.2
N$62: Q4.G R31.2
N$63: Q6.G R33.2
N$64: LED5.A R34.2
N$65: LED6.A R35.2
N$66: LED7.A R36.2
N$67: U$3.RST U$3.SLP(SLEEP)
N$68: JP10.1 R5.1 U$3.MS1
N$69: JP8.1 R4.2 U$2.MS1
N$70: JP8.3 U$2.MS2
N$71: JP12.1 R9.1 U$9.MS1
N$72: JP12.3 U$9.MS2
N$73: JP11.5 U$10.MS3
N$74: JP11.1 R15.1 U$10.MS1
N$75: JP10.5 U$3.MS3
N$76: JP10.3 U$3.MS2
N$77: E0-MOT1.1 U$2.2B
N$78: E0-MOT1.2 U$2.2A
N$79: E0-MOT1.3 U$2.1A
N$80: E0-MOT1.4 U$2.1B
N$81: E1-MOT1.1 U$3.2B
N$82: E1-MOT1.2 U$3.2A
N$83: E1-MOT1.3 U$3.1A
N$84: E1-MOT1.4 U$3.1B
N$85: U$9.2B X-MOT1.1
N$86: U$9.2A X-MOT1.2
N$87: U$9.1A X-MOT1.3
N$88: U$9.1B X-MOT1.4
N$89: U$10.2B Y-MOT1.1
N$90: U$10.2A Y-MOT1.2
N$91: U$10.1A Y-MOT1.3
N$92: U$10.1B Y-MOT1.4
N$93: JP13.3 U$11.MS2
N$94: U$11.RST U$11.SLP(SLEEP)
N$95: JP13.5 U$11.MS3
N$96: JP13.1 R16.1 U$11.MS1
N$97: U$11.2B Z-MOT2.1 Z-MOT3.1
N$98: U$11.2A Z-MOT2.2 Z-MOT3.2
N$99: U$11.1A Z-MOT2.3 Z-MOT3.3
N$100: U$11.1B Z-MOT2.4 Z-MOT3.4
PA0: IC3.78((AD0)PA0) XIO.3
PA1: XIO.4
PA2: XIO.5
PA3: XIO.6
PA4: XIO.7
PA5: XIO.8
PA6: XIO.9
PA7: XIO.10
PB0: XIO.34
PC0: XIO.18
PC1: XIO.17
PC2: XIO.16
PC3: XIO.15
PC4: XIO.14
PC5: XIO.13
PC6: XIO.12
PC7: XIO.11
PD7: XIO.19
PE0: RN4.2
PE1: RN4.1
PG0: XIO.22
PG1: XIO.21
PG2: XIO.20
PH4: IC3.16(PH4(OC4B)) PWML.8
PL0: XIO.30
PL1: XIO.29
PL2: XIO.28
PL3: XIO.27
PL4: XIO.26
PL6: XIO.24
PL7: XIO.23
PWRIN [power]: D1.A X1.2
RD+: IC4.29(D+) RN2.4
RD-: IC4.30(D-) RN2.1
RESET: AVRISP6.5 C1.1 C7.2 D3.A IC3.30(RESET) POWER.3 RESET-EN.1 RESET-EN.2 RN5.1 S2.2(S)
RESET2: D2.A IC4.24(RESET(PC1/DW)) ICSP1.5 RN5.7
RXL: IC4.10((INT5/AIN3)PD4) RX.C
SCK: AUX-3.5 AVRISP6.3 IC3.20((SCK/PCINT1)PB1) XIO.33
SCK2: IC4.15((SCLK/PCINT1)PB1) ICSP1.3
SCL: I2C1.4 IC3.43((SCL/INT0)PD0) R29.1
SDA: I2C1.3 IC3.44((SDA/INT1)PD1) R28.1
THERM0: C27.+ IC3.84(PK5(ADC13/PCINT21)) JP9.2 R24.1
THERM1: C26.+ IC3.83(PK6(ADC14/PCINT22)) JP9.4 R23.1
THERM2: C28.+ IC3.82(PK7(ADC15/PCINT23)) JP9.6 R30.1
TXL: IC4.11((XCK/AIN4/PCINT12)PD5) TX.C
UGND [gnd]: C10.2 GROUND.1 IC4.28(UGND) L1.1 X2.4
USBVCC [power usb]: C8.1 F1.1 IC4.31(UVCC) T1.1(D)
USHIELD [gnd]: L1.2 X2.P$1 X2.P$2 Z1.1 Z2.1
VCC: A-OUT1.1 AUX-2.1 AUX-3.1 AUX-4.1 I2C1.1 JP8.2 JP8.4 JP8.6 JP10.2 JP10.4 JP10.6 JP11.2 JP11.4 JP11.6 JP12.2 JP12.4 JP12.6 JP13.2 JP13.4 JP13.6 R17.1 R23.2 R24.2 R25.1 R26.1 R27.1 R28.2 R29.2 R30.2 R37.1 SERIAL1.1 U$2.VDD U$3.VDD U$9.VDD U$10.VDD U$11.VDD VCC1.1 X+1.3 X-1.3 Y+1.3 Y-1.3 Z+1.3 Z-1.3
VIN [power]: C2.1 D1.C IC1.3(IN) PC1.+ POWER.8 RN5.6
VUCAP: C10.1 IC4.27(UCAP)
X-DIR: IC3.96((ADC1)PF1) U$9.DIR
X-EN: IC3.50((T0)PD7) R26.2 U$9.EN
X-MAX: IC3.6((OC3B/INT4)PE4) X+1.1
X-MIN: IC3.7((OC3C/INT5)PE5) X-1.1
X-STEP: IC3.97((ADC0)PF0) U$9.STEP
XT1: C14.1 IC4.1(XTAL1) R2.1 Y2.2
XT2: C15.1 IC4.2(XTAL2(PC0)) R2.2 Y2.1
XTAL1: IC3.34(XTAL1) R1.1 Y1.3
XTAL2: IC3.33(XTAL2) R1.2 Y1.1
XVCC [power usb]: F1.2 X2.1
Y-DIR: IC3.90((ADC7/TDI)PF7) U$10.DIR
Y-EN: IC3.95((ADC2)PF2) R27.2 U$10.EN
Y-MAX: IC3.63(PJ0(RXD3/PCINT9)) Y+1.1
Y-MIN: IC3.64(PJ1(TXD3/PCINT10)) Y-1.1
Y-STEP: IC3.91((ADC6/TDO)PF6) U$10.STEP
Z-DIR: IC3.36(PL1(ICP5)) U$11.DIR
Z-EN: IC3.89(PK0(ADC8/PCINT16)) R37.2 U$11.EN
Z-MAX: IC3.45((RXD1/INT2)PD2) Z+1.1
Z-MIN: IC3.46((TXD1/INT3)PD3) Z-1.1
Z-STEP: IC3.38(PL3(OC5A)) U$11.STEP
Unconnected: AUX-3.8 IC2.2(A:O) IC2.3(A:I) IC2.4(B:O) IC2.5(B:I) IC2.6(C:O) IC2.7(C:I) IC2.9(D:I) IC2.10(D:O) IC2.11(E:I) IC2.12(E:O) IC2.14(F:I) IC2.15(F:O) IC3.4((XCK0/AIN0)PE2) IC3.8((T3/INT6)PE6) IC3.9((CLKO/ICP3/INT7)PE7) IC3.14(PH2(XCK2)) IC3.27(PH7(T4)) IC3.28((TOSC2)PG3) IC3.29((TOSC1)PG4) IC3.47((ICP1)PD4) IC3.48((XCK1)PD5) IC3.49((T1)PD6) IC3.65(PJ2(XCK3/PCINT11)) IC3.66(PJ3(PCINT12)) IC3.67(PJ4(PCINT13)) IC3.68(PJ5(PCINT14)) IC3.69(PJ6(PCINT15)) IC3.79(PJ7) IC4.5((AIN2/PCINT11)PC2) IC4.6((OC0B/INT0)PD0) IC4.7((AIN0/INT1)PD1) IC4.12((RTS/AIN5/INT6)PD6) IC4.14((SS/PCINT0)PB0) IC4.22((INT4/ICP1/CLK0)PC7) IC4.23((OC1A/PCINT8)PC6) IC4.25((PCINT9/OC1B)PC5) IC4.26((PCINT10)PC4) IC5.1(PD3(INT1)) IC5.2(PD4(XCK/T0)) IC5.7(PB6(XTAL1/TOSC1)) IC5.8(PB7(XTAL2/TOSC2)) IC5.9(PD5(T1)) IC5.10(PD6(AIN0)) IC5.11(PD7(AIN1)) IC5.12(PB0(ICP)) IC5.13(PB1(OC1A)) IC5.14(PB2(SS/OC1B)) IC5.15(PB3(MOSI/OC2)) IC5.16(PB4(MISO)) IC5.17(PB5(SCK)) IC5.19(ADC6) IC5.20(AREF) IC5.22(ADC7) IC5.23(PC0(ADC0)) IC5.24(PC1(ADC1)) IC5.25(PC2(ADC2)) IC5.26(PC3(ADC3)) IC5.27(PC4(ADC4/SDA)) IC5.28(PC5(ADC5/SCL)) IC5.29(PC6(/RESET)) IC5.30(PD0(RXD)) IC5.31(PD1(TXD)) IC5.32(PD2(INT0)) IC6.4(NC/FB) JP6.1 JP6.2 JP6.5 JP6.6 JP6.7 JP6.8 JP6.9 JP6.10 POWER.1 PWML.1 PWML.2 PWML.3 PWML.4 PWML.5 PWML.6 PWML.7 RN2.2 RN2.3 RN2.6 RN2.7 RN3.3 RN3.6 SV1.1 SV1.2 SV1.3 SV1.4 SV1.5 SV1.6 SV1.7 SV1.8 SV1.9 SV1.10 SV1.11 SV1.12 U1.3.3V U1.5V@1(5V) U1.5V@2(5V) U1.A0 U1.A1 U1.A2 U1.A3 U1.A4 U1.A5 U1.A6 U1.A7 U1.A8 U1.A9 U1.A10 U1.A11 U1.A12 U1.A13 U1.A14 U1.A15 U1.AREF U1.D2(*D2) U1.D3(*D3) U1.D4 U1.D5 U1.D6 U1.D7 U1.D8 U1.D9 U1.D10 U1.D11 U1.D12 U1.D13 U1.D14 U1.D15 U1.D16 U1.D17 U1.D18(*D18) U1.D19(*D19) U1.D20(*D20) U1.D21(*D21) U1.D22 U1.D23 U1.D24 U1.D25 U1.D26 U1.D27 U1.D28 U1.D29 U1.D30 U1.D31 U1.D32 U1.D33 U1.D34 U1.D35 U1.D36 U1.D37 U1.D38 U1.D39 U1.D40 U1.D41 U1.D42 U1.D43 U1.D44 U1.D45 U1.D46 U1.D47 U1.D48 U1.D49 U1.D50 U1.D51 U1.D52 U1.D53 U1.GND@0(GND) U1.GND@1(GND) U1.GND@2(GND) U1.GND@3(GND) U1.GND@4(GND) U1.RES U1.RX U1.TX U1.VIN

## Notes on the sheet
- Концевые 
  датчики
- Power
- Endstops
- AUX-3
- AUX-2
- AUX-4
- Stepper Drivers
- E0 | E1
- X | Y | Z
- не использованы
  d7 = ph4
  d22 =  pa0
  aref
- Arduino   MEGA 2560
- 53 | (SS) | (SCK) | 52
- 51 | (MOSI) | (MISO) | 50
- 13
- 49 | 48 | megatronix2 флаг совместимости
- 12
- 47 | 46
- 11
- 45 | 44
- 10
- 43 | 42
- 9
- 41 | 40
- 8
- 39 | 38
- 37 | 36 | LED
- 35 | 34
- 33 | 32
- 31 | 30 | 7
- 29 | 28 | 6
- 27 | 26 | 5
- 25 | 24 | 4
- 23 | 22 | 3
- 2
- 1
- 0
- USB
- megatronix2
- Термопары
- Thermistor 0 | Нагреватели
- USB boot En
- Thermistor 1
- megatronix2
- megatronix2
- megatronix2 | I2C
- megatronix2 | megatronix2
- megatronix2
- megatronix2
- Thermistor 2
- (TX0) | megatronix2
- (RX0) | megatronix2 | AUX-1
- Thermistors
- Heaters & Fans
- megatronix2
- megatronix2
- Servos | Servos

## Power pins joined to a net without a drawn wire
5V: U1.5V@0(5V)
AVCC: IC5.18(AVCC)
GND: IC5.3(GND) IC5.5(GND) IC5.21(GND)
VCC: IC5.4(VCC) IC5.6(VCC)
VDD: IC2.1(P:VDD)
VSS: IC2.8(P:VSS)

## Library data of the parts
5V1 PS-ON1 VCC1 = adafruit:PINHD-1X1: Pin header 1x1 for 0.1" spacing With round pins
12V-AUX1 = SparkFun:M02: Header 2 Standard 2-pin 0.1" header. Use with straight break away headers (SKU : PRT-00116), right angle break away headers (PRT-00553), swiss pins (PRT-00743), machine pins (PRT-00117), and female headers (PRT-00115). Molex polarized connector foot print use with SKU : PRT-08233 with associated crimp pins and housings.
A-OUT1 E0-MOT1 E1-MOT1 I2C1 SERIAL1 X-MOT1 Y-MOT1 Z-MOT2 Z-MOT3 = RepRapjr:PINHD-1X4: PIN HEADER
AUX-2 = RepRapjr:M05X2
AUX-3 = SparkFun:M04X2
AUX-4 = SparkFun:M18
AVRISP6 ICSP1 = SmartPrj:PINHD-2X3: PIN HEADER
C1-C15 = SmartPrj:C-EU: CAPACITOR, European symbol
C16 C18-C20 C26-C30 = adafruit:CPOL-US: POLARIZED CAPACITOR, American symbol
C17 = resistor:C-EU: CAPACITOR, European symbol
D1-D3 = diode:DIODE-: DIODE
D6 D7 = diode:1N4004: DIODE general purpose rectifier, 1 A
F1 = rcl:L-EU: INDUCTOR, European symbol
F4 F5 = RepRapjr:PTCFUSE: LITTLEFUSE Picofuse/slow Littlefuse
FD1-FD4 = SmartPrj:FIDUCIALMOUNT
GROUND RESET-EN = jumper:SJ: SMD solder JUMPER
IC1 = linear:MC33269ST*: Adjustable Output Low Dropout Voltage Regulator 800 mA Source: http://www.onsemi.com/pub/Collateral/MC33269-D.PDF
IC2 = 40xx:4050: Hex non-inverting BUFFER
IC3 = SmartPrj:ATMEGA2560: MICROCONTROLLER 64/128/256 Kbytes FLASH 4 Kbytes EEPROM 8 Kbytes SRAM 86 General Purpose I/O pins 12-channels16-bit PWM 4 x Serial USARTs 16-channels 10-bit A/D
IC4 = SmartPrj:ATMEGA16U2-
IC5 = atmel:MEGA8: MICROCONTROLLER 8 Kbytes FLASH, 1 kbytes SRAM, 512 bytes EEPROM, USART, 6-channel 10 bit ADC, 2-channel 8 bit ADC Pin compatible with Atmega48, ATMega88, ATMega168 Source: avr.lbr; MPN: ATMEGA8-16AU; OC_FARNELL: 9171371; OC_NEWARK: 73M8863
IC6 = SmartPrj:LP2985-XXDBVR: ULTRALOW-POWER 50-mA LOW-DROPOUT LINEAR REGULATORS 50-mA Low-Dropout Regulator Source: http://focus.ti.com/lit/ds/symlink/tps77001.pdf
IC7 = linear:LMV358?*: Dual General Purpose, Low Voltage, Rail-to-Rail Output Operational Amplifiers Source: http://www.national.com/mpf/LM/LMV321.html http://www.national.com/dt/lmv_qual.pdf
JP5 = SmartPrj:PINHD-2X2: PIN HEADER
JP6 = SmartPrj:PINHD-1X10_ARD: PIN HEADER
JP8 JP10-JP13 = pinhead:PINHD-2X3: PIN HEADER
JP9 = SparkFun:M06: Header 6 Standard 6-pin 0.1" header. Use with straight break away headers (SKU : PRT-00116), right angle break away headers (PRT-00553), swiss pins (PRT-00743), machine pins (PRT-00117), and female headers (PRT-00115). Molex polarized connector foot print use with SKU : PRT-08094 with associated crimp pins and housings. NOTES ON THE VARIANTS LOCK and LOCK_LONGPADS... This footprint was designed to help hold the alignment of a through-hole component (i.e. 6-pin header) while soldering it into place. You may notice that each hole has been shifted either up or down by 0.005 of an inch from it's more standard position (which is a perfectly straight line). This slight alteration caused the pins (the squares in the middle) to touch the edges of the holes. Because they are alternating, it causes a "brace" to hold the component in place. 0.005 has proven to be the perfect amount of "off-center" position when using our standard breakaway headers. Although looks a little odd when you look at the bare footprint, once you have a header in there, the alteration is very hard to notice. Also, if you push a header all the way into place, it is covered up entirely on the bottom side. This idea of altering the position of holes to aid alignment will be further integrated into the Sparkfun Library for other footprints. It can help hold any component with 3 or more connection pins.
L LED1 LED5-LED7 ON RX TX = led:LED: LED OSRAM: - CHIPLED LG R971, LG N971, LY N971, LG Q971, LY Q971, LO R971, LY R971 LH N974, LH R974 LS Q976, LO Q976, LY Q976 LO Q996 - Hyper CHIPLED LW Q18S LB Q993, LB Q99A, LB R99A - SideLED LS A670, LO A670, LY A670, LG A670, LP A670 LB A673, LV A673, LT A673, LW A673 LH A674 LY A675 LS A676, LA A676, LO A676, LY A676, LW A676 LS A679, LY A679, LG A679 - Hyper Micro SIDELED® LS Y876, LA Y876, LO Y876, LY Y876 LT Y87S - SmartLED LW L88C, LW L88S LB L89C, LB L89S, LG L890 LS L89K, LO L89K, LY L89K LS L896, LA L896, LO L896, LY L896 - TOPLED LS T670, LO T670, LY T670, LG T670, LP T670 LSG T670, LSP T670, LSY T670, LOP T670, LYG T670 LG T671, LOG T671, LSG T671 LB T673, LV T673, LT T673, LW T673 LH T674 LS T676, LA T676, LO T676, LY T676, LB T676, LH T676, LSB T676, LW T676 LB T67C, LV T67C, LT T67C, LS T67K, LO T67K, LY T67K, LW E67C LS E67B, LA E67B, LO E67B, LY E67B, LB E67C, LV E67C, LT E67C LW T67C LS T679, LY T679, LG T679 LS T770, LO T770, LY T770, LG T770, LP T770 LB T773, LV T773, LT T773, LW T773 LH T774 LS E675, LA E675, LY E675, LS T675 LS T776, LA T776, LO T776, LY T776, LB T776 LHGB T686 LT T68C, LB T68C - Hyper Mini TOPLED® LB M676 - Mini TOPLED Santana® LG M470 LS M47K, LO M47K, LY M47K Source: http://www.osram.convergy.de LUXEON: - LUMILED® LXK2-PW12-R00, LXK2-PW12-S00, LXK2-PW14-U00, LXK2-PW14-V00 LXK2-PM12-R00, LXK2-PM12-S00, LXK2-PM14-U00 LXK2-PE12-Q00, LXK2-PE12-R00, LXK2-PE12-S00, LXK2-PE14-T00, LXK2-PE14-U00 LXK2-PB12-K00, LXK2-PB12-L00, LXK2-PB12-M00, LXK2-PB14-N00, LXK2-PB14-P00, LXK2-PB14-Q00 LXK2-PR12-L00, LXK2-PR12-M00, LXK2-PR14-Q00, LXK2-PR14-R00 LXK2-PD12-Q00, LXK2-PD12-R00, LXK2-PD12-S00 LXK2-PH12-R00, LXK2-PH12-S00 LXK2-PL12-P00, LXK2-PL12-Q00, LXK2-PL12-R00 Source: www.luxeon.com KINGBRIGHT: KA-3528ASYC Source: www.kingbright.com
L1 = wuerth-elektronik:WE-CBF: SMD EMI Suppression Ferrite Beads - excellent anti-EMI properties - low DCR - impedances till 3000 ohms - rated current up to 6 A
PC1 PC2 = rcl:CPOL-EU: POLARIZED CAPACITOR, European symbol
POWER PWML = SmartPrj:PINHD-1X8: PIN HEADER
Q4-Q6 = transistor-power:IRF512: N-CHANNEL MOS FET
R1 R2 = SmartPrj:R-EU_: RESISTOR, European symbol
R3-R5 R7 R9 R13-R17 R23-R30 R34-R37 = adafruit:R-US_: RESISTOR, American symbol
R31-R33 = resistor:R-US_: RESISTOR, American symbol
RN2-RN5 = resistor-dil:4R-N: Array Chip Resistor Source: RS Component / Phycomp
S2 = switch-omron:31-XX: OMRON SWITCH; MPN: B3F-3100; OC_FARNELL: 959704; OC_NEWARK: 36M3582
SER0 SER1-SER3 X+1 X-1 Y+1 Y-1 Z+1 Z-1 = ultimachine:3PIN-HEADER: PIN HEADER
SV1 = con-lsta:FE12-1: FEMALE HEADER; OC_FARNELL: unknown; OC_NEWARK: unknown
T1 = zetex:PMOSSOT23: MOS FET
U1 = RepRapjr:ARDUINO_MEGA_SHIELD
U$1 = RepRapjr:282837-6
U$2 U$3 U$9-U$11 = RepRapjr:A4988BREAKOUT
X1 = SmartPrj:POWERSUPPLY_DC21MM
X2 = SmartPrj:PN61729: BERG USB connector
X3 = con-phoenix-508:MSTBA4: PHOENIX
XIO = SmartPrj:PINHD-2X18: PIN HEADER
Y1 = SmartPrj:RESONATOR
Y2 = SmartPrj:XTAL/S: CRYSTAL
Z1 Z2 = varistor:VARISTOR: VARISTOR

## Net classes
0 default: width 0.203 mm, drill 0.406 mm, clearance 0.203 mm
1 power: width 0.61 mm, drill 0.406 mm, clearance 0.203 mm
2 gnd: width 0.305 mm, drill 0.406 mm, clearance 0.203 mm
3 power usb: width 0.508 mm, drill 0.406 mm, clearance 0.203 mm